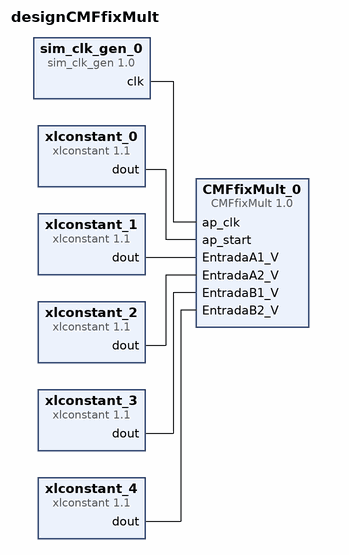
[diagram p0: block diagram of the top level]
# Vivado block design designCMFfixMult, xc7z020clg484-1, Vivado 2018.3
create_bd_design designCMFfixMult

create_bd_cell -type ip -vlnv xilinx.com:user:CMFfixMult:1.0 CMFfixMult_0
create_bd_cell -type ip -vlnv xilinx.com:ip:sim_clk_gen:1.0 sim_clk_gen_0
set_property -dict {CONFIG.RESET_POLARITY ACTIVE_HIGH} [get_bd_cells sim_clk_gen_0]
create_bd_cell -type ip -vlnv xilinx.com:ip:xlconstant:1.1 xlconstant_0
create_bd_cell -type ip -vlnv xilinx.com:ip:xlconstant:1.1 xlconstant_1
set_property -dict {CONFIG.CONST_VAL 22 CONFIG.CONST_WIDTH 18} [get_bd_cells xlconstant_1]
create_bd_cell -type ip -vlnv xilinx.com:ip:xlconstant:1.1 xlconstant_2
set_property -dict {CONFIG.CONST_VAL 77 CONFIG.CONST_WIDTH 18} [get_bd_cells xlconstant_2]
create_bd_cell -type ip -vlnv xilinx.com:ip:xlconstant:1.1 xlconstant_3
set_property -dict {CONFIG.CONST_VAL 6 CONFIG.CONST_WIDTH 9} [get_bd_cells xlconstant_3]
create_bd_cell -type ip -vlnv xilinx.com:ip:xlconstant:1.1 xlconstant_4
set_property -dict {CONFIG.CONST_VAL 3 CONFIG.CONST_WIDTH 9} [get_bd_cells xlconstant_4]

# ---- connections ----

connect_bd_net [get_bd_pins sim_clk_gen_0/clk] [get_bd_pins CMFfixMult_0/ap_clk]
connect_bd_net [get_bd_pins xlconstant_0/dout] [get_bd_pins CMFfixMult_0/ap_start]
connect_bd_net [get_bd_pins xlconstant_1/dout] [get_bd_pins CMFfixMult_0/EntradaA1_V]
connect_bd_net [get_bd_pins xlconstant_2/dout] [get_bd_pins CMFfixMult_0/EntradaA2_V]
connect_bd_net [get_bd_pins xlconstant_3/dout] [get_bd_pins CMFfixMult_0/EntradaB1_V]
connect_bd_net [get_bd_pins xlconstant_4/dout] [get_bd_pins CMFfixMult_0/EntradaB2_V]

validate_bd_design
save_bd_design
